# Altium schematic sheet AUDIO CODEC.SchDoc: AUDIO CODEC
size A4; DocumentNumber: 5; Revision: 2.0; SheetNumber: 5; SheetTotal: 18
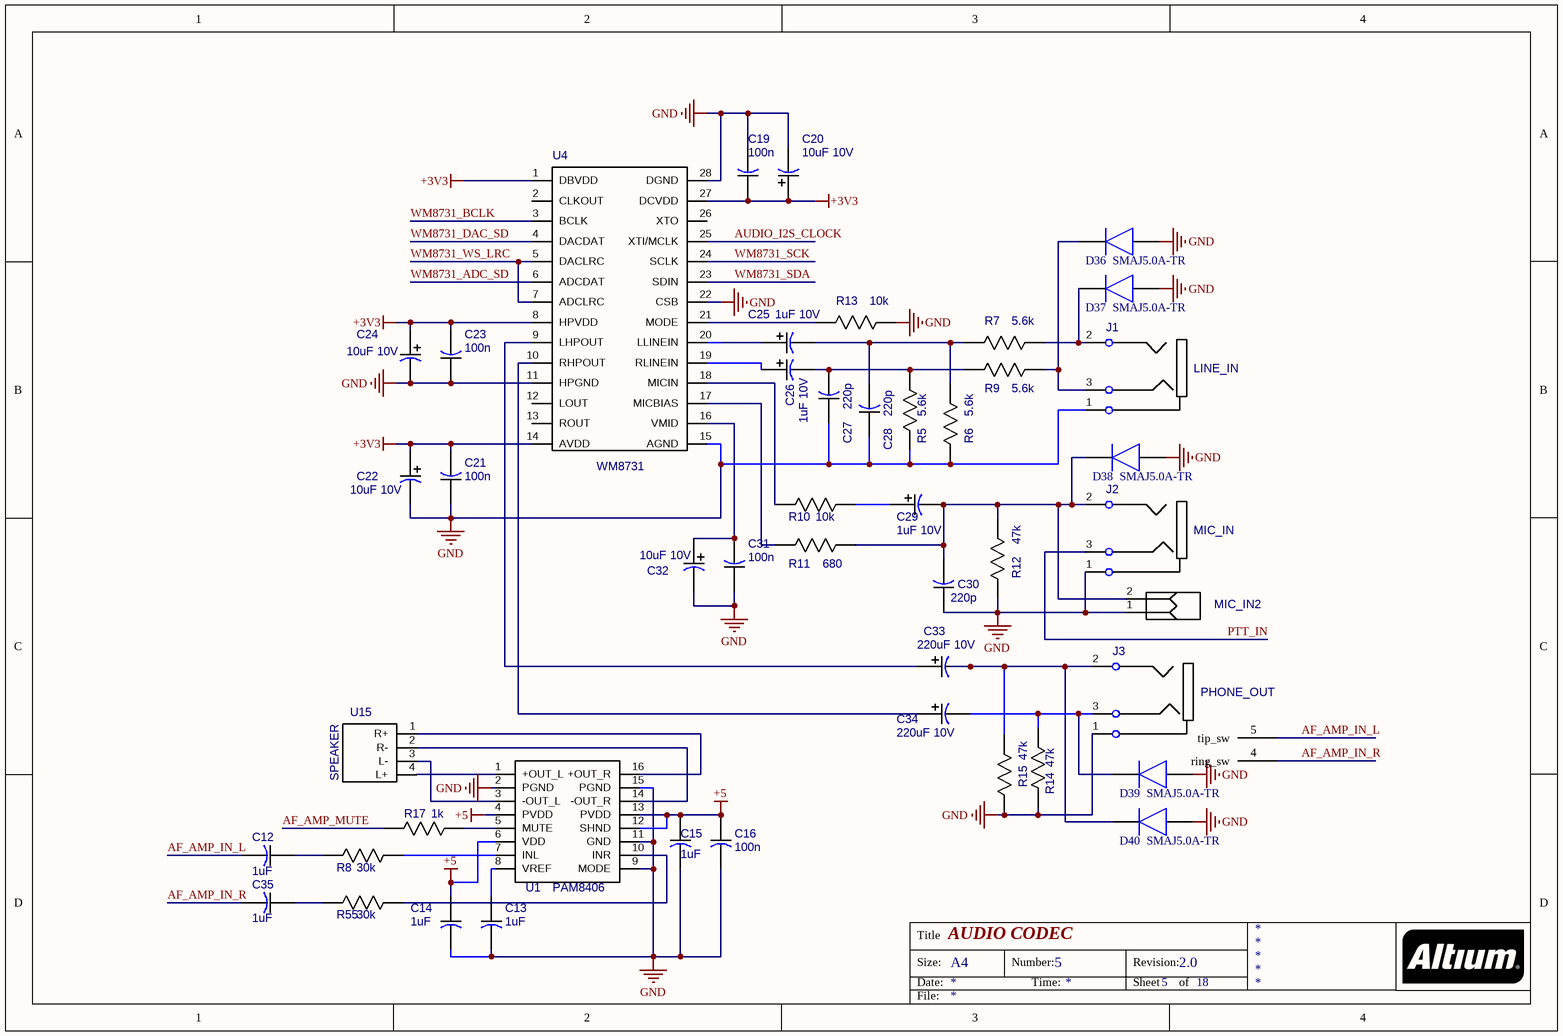
[diagram p0: AUDIO CODEC.SchDoc]

## Parts
C12  1uF  [CAP_0805]
C13  1uF  [CAP_0805]
C14  1uF  [CAP_0805]
C15  1uF  [CAP_0805]
C16  100n  [CAP_0805]
C19  100n  [CAP_0805]
C20  10uF 10V  [CAPAE_4.3x4.3h5.4]
C21  100n  [CAP_0805]
C22  10uF 10V  [CAPAE_4.3x4.3h5.4]
C23  100n  [CAP_0805]
C24  10uF 10V  [CAPAE_4.3x4.3h5.4]
C25  1uF 10V  [CAPAE_4.3x4.3h5.4]
C26  1uF 10V  [CAPAE_4.3x4.3h5.4]
C27  220p  [CAP_0805]
C28  220p  [CAP_0805]
C29  1uF 10V  [CAPAE_4.3x4.3h5.4]
C30  220p  [CAP_0805]
C31  100n  [CAP_0805]
C32  10uF 10V  [CAPAE_4.3x4.3h5.4]
C33  220uF 10V  [EEEFC_sizeС]
C34  220uF 10V  [EEEFC_sizeС]
C35  1uF  [CAP_0805]
D36  SMAJ5.0A-TR  [SMBJ36CATR]
D37  SMAJ5.0A-TR  [SMBJ36CATR]
D38  SMAJ5.0A-TR  [SMBJ36CATR]
D39  SMAJ5.0A-TR  [SMBJ36CATR]
D40  SMAJ5.0A-TR  [SMBJ36CATR]
J1  value LINE_IN  [SJ1-3525NG]  (hidden comment: SJ1-3525NG)
J2  value MIC_IN  [SJ1-3525NG]  (hidden comment: SJ1-3525NG)
J3  value PHONE_OUT  [SJ1-3525NG]  (hidden comment: SJ1-3525NG)
MIС_IN2  MIС_IN2  [51022-0200]  (value not drawn)
R5  5.6k  [RES_0805]
R6  5.6k  [RES_0805]
R7  5.6k  [RES_0805]
R8  30k  [RES_0805]
R9  5.6k  [RES_0805]
R10  10k  [RES_0805]
R11  680  [RES_0805]
R12  47k  [RES_0805]
R13  10k  [RES_0805]
R14  47k  [RES_0805]
R15  47k  [RES_0805]
R17  1k  [RES_0805]
R55  30k  [RES_0805]
U1  PAM8406  [PAM8403]
U4  WM8731  [WM8731]
U15  SPEAKER  [speaker conn]

## Nets
+3V3: C19.1 C20.1(PLUS) C21.2 C22.1(PLUS) C23.2 C24.1(PLUS) U4.1(DBVDD) U4.8(HPVDD) U4.14(AVDD) U4.27(DCVDD)
+5: C14.1 C15.1 C16.1 U1.4(PVDD) U1.6(VDD) U1.12(SHND) U1.13(PVDD)
GND: C13.2 C14.2 C15.2 C16.2 C19.2 C20.2(MINUS) C21.1 C22.2(MINUS) C23.1 C24.2(MINUS) C27.1 C28.1 C30.1 C31.1 C32.2(MINUS) D36.2(A) D37.2(A) D38.2(A) D39.2(A) D40.2(A) J1.1(sleeve) J2.1(sleeve) J3.1(sleeve) MIС_IN2.1 R5.1 R6.1 R12.1 R13.1 R14.1 R15.1 U1.2(PGND) U1.9(MODE) U1.11(GND) U1.15(PGND) U4.11(HPGND) U4.15(AGND) U4.22(CSB) U4.28(DGND)
AF_AMP_IN_L: C12.2 J3.5(tip_sw)
AF_AMP_IN_R: C35.2 J3.4(ring_sw)
AF_AMP_MUTE: R17.2
AUDIO_I2S_CLOCK: U4.25(XTI/MCLK)
PTT_IN: J2.3(ring)
WM8731_ADC_SD: U4.6(ADCDAT)
WM8731_BCLK: U4.3(BCLK)
WM8731_DAC_SD: U4.4(DACDAT)
WM8731_SCK: U4.24(SCLK)
WM8731_SDA: U4.23(SDIN)
WM8731_WS_LRC: U4.5(DACLRC) U4.7(ADCLRC)
NetC12_1: C12.1 R8.2
NetC13_1: C13.1 U1.8(VREF)
NetC25_1: C25.1(PLUS) U4.20(LLINEIN)
NetC25_2: C25.2(MINUS) C28.2 R6.2 R7.2
NetC26_1: C26.1(PLUS) U4.19(RLINEIN)
NetC26_2: C26.2(MINUS) C27.2 R5.2 R9.2
NetC29_1: C29.1(PLUS) R10.1
NetC29_2: C29.2(MINUS) C30.2 D38.1(K) J2.2(tip) MIС_IN2.2 R11.1 R12.2
NetC31_2: C31.2 C32.1(PLUS) U4.16(VMID)
NetC33_1: C33.1(PLUS) U4.9(LHPOUT)
NetC33_2: C33.2(MINUS) D40.1(K) J3.2(tip) R15.2
NetC34_1: C34.1(PLUS) U4.10(RHPOUT)
NetC34_2: C34.2(MINUS) D39.1(K) J3.3(ring) R14.2
NetC35_1: C35.1 R55.2
NetD36_1: D36.1(K) J1.3(ring) R9.1
NetD37_1: D37.1(K) J1.2(tip) R7.1
NetR8_1: R8.1 U1.7(INL)
NetR10_2: R10.2 U4.18(MICIN)
NetR11_2: R11.2 U4.17(MICBIAS)
NetR13_2: R13.2 U4.21(MODE)
NetR17_1: R17.1 U1.5(MUTE)
NetR55_1: R55.1 U1.10(INR)
NetU1_1: U1.1(+OUT_L) U15.4(L+)
NetU1_3: U1.3(-OUT_L) U15.3(L-)
NetU1_14: U1.14(-OUT_R) U15.2(R-)
NetU1_16: U1.16(+OUT_R) U15.1(R+)

Not connected (* = marked no-connect by the designer): U4 2(CLKOUT) 12(LOUT) 13(ROUT) 26(XTO)

## Notes on the sheet
- Title
- Size:
- Date:
- A4
- Number:
- Time:
- Revision:
- Sheet
- of
- File:

## Library data of the parts
C12-C16 C19 C21 C23 C27 C28 C30 C31 C35 = CAP_0805
  C12 C14 C15 C35: Value: 1uF
  C16 C19 C21 C23 C31: Value: 100n
  C27 C28 C30: Value: 220p
C20 C22 C24-C26 C29 C32-C34 = CAPAE_4.3x4.3h5.4
  C20 C22 C24 C32: Value: 10uF 10V
  C25 C26 C29: Value: 1uF 10V
  C33 C34: Value: 220uF 10V
D36-D40 = SMLVT3V3: Diode; Manufacturer_Name: STMicroelectronics; Allied_Number: 70013736; Datasheet Link: http://www.st.com/web/en/resource/technical/document/datasheet/CD00000923.pdf; Height: 2.65mm; Manufacturer_Part_Number: SMLVT3V3; Mouser Part Number: 511-SMLVT3V3; Mouser Price/Stock: https://www.mouser.com/Search/Refine.aspx?Keyword=511-SMLVT3V3; RS Part Number: 5444821P; RS Price/Stock: http://uk.rs-online.com/web/p/products/5444821P; Allied Price/Stock: http://www.alliedelec.com/stmicroelectronics-smlvt3v3/70013736/
J1-J3 = SJ1-3523N
MIС_IN2 = 51022-0200: 2 Pin
R5-R15 R17 R55 = RES_0805
  R5-R7 R9: Value: 5.6k
  R10 R13: Value: 10k
  R11: Value: 680
  R12 R14 R15: Value: 47k
U15 = speaker conn: 4 pins conn; Value: *
U4 = WM8731: Value: WM8731